# EAGLE design main (EAGLE 9.5.2)
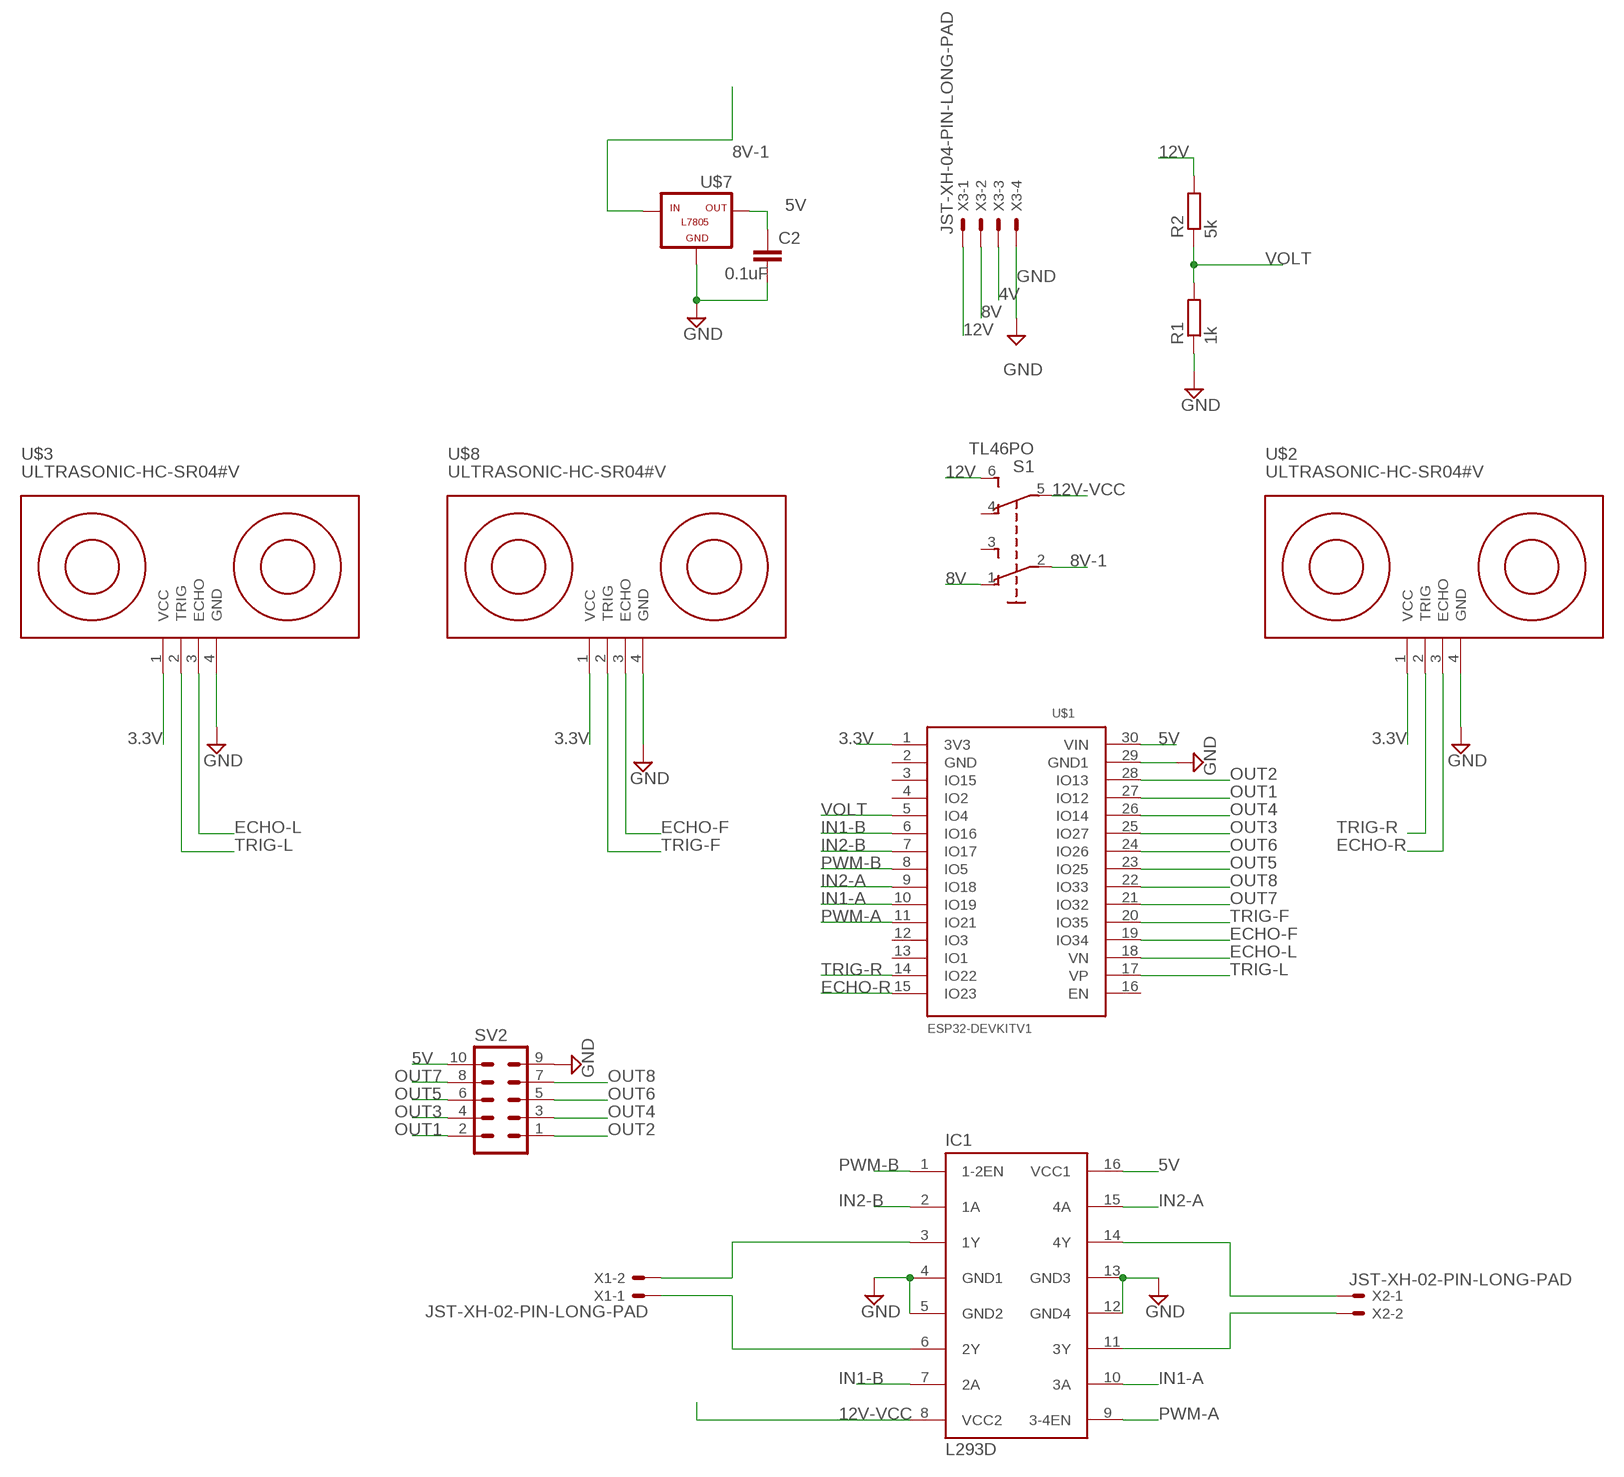
[diagram p0: schematic, sheet 1]

## Parts
C2  0.1uF  C2,5-3  [C2.5-3]
IC1  L293D  [DIL16]
R1  1k  R-EU_0207/10  [0207/10]
R2  5k  R-EU_0207/10  [0207/10]
S1  TL46PO  [TL4XPO]
SV2  MA05-2  [MA05-2]
U$1  ESP32DEVKITV1  [ESP32-DEVKITV1]
U$2  ULTRASONIC-HC-SR04#V  [ULTRASONIC-HC-SR04#V]
U$3  ULTRASONIC-HC-SR04#V  [ULTRASONIC-HC-SR04#V]
U$7  -L7805  [L7805]
U$8  ULTRASONIC-HC-SR04#V  [ULTRASONIC-HC-SR04#V]
X1  JST-XH-02-PIN-LONG-PAD  [JST-XH-02-PACKAGE-LONG-PAD]
X2  JST-XH-02-PIN-LONG-PAD  [JST-XH-02-PACKAGE-LONG-PAD]
X3  JST-XH-04-PIN-LONG-PAD  [JST-XH-04-PACKAGE-LONG-PAD]

## Nets
3.3V: U$1.1(3V3) U$2.1(VCC) U$3.1(VCC) U$8.1(VCC)
4V: X3.3
5V: C2.1 IC1.16(VCC1) SV2.10 U$1.30(VIN) U$7.OUT
8V: S1.1(O) X3.2
8V-1: S1.2(P) U$7.IN
12V: R2.2 S1.6(S1) X3.1
12V-VCC: IC1.8(VCC2) S1.5(P1)
ECHO-F: U$1.19(IO34) U$8.3(ECHO)
ECHO-L: U$1.18(VN) U$3.3(ECHO)
ECHO-R: U$1.15(IO23) U$2.3(ECHO)
GND: C2.2 IC1.4(GND1) IC1.5(GND2) IC1.12(GND4) IC1.13(GND3) R1.1 SV2.9 U$1.29(GND1) U$2.4(GND) U$3.4(GND) U$7.GND U$8.4(GND) X3.4
IN1-A: IC1.10(3A) U$1.10(IO19)
IN1-B: IC1.7(2A) U$1.6(IO16)
IN2-A: IC1.15(4A) U$1.9(IO18)
IN2-B: IC1.2(1A) U$1.7(IO17)
N$1: IC1.3(1Y) X1.2
N$2: IC1.6(2Y) X1.1
N$3: IC1.14(4Y) X2.1
N$4: IC1.11(3Y) X2.2
OUT1: SV2.2 U$1.27(IO12)
OUT2: SV2.1 U$1.28(IO13)
OUT3: SV2.4 U$1.25(IO27)
OUT4: SV2.3 U$1.26(IO14)
OUT5: SV2.6 U$1.23(IO25)
OUT6: SV2.5 U$1.24(IO26)
OUT7: SV2.8 U$1.21(IO32)
OUT8: SV2.7 U$1.22(IO33)
PWM-A: IC1.9(3-4EN) U$1.11(IO21)
PWM-B: IC1.1(1-2EN) U$1.8(IO5)
TRIG-F: U$1.20(IO35) U$8.2(TRIG)
TRIG-L: U$1.17(VP) U$3.2(TRIG)
TRIG-R: U$1.14(IO22) U$2.2(TRIG)
VOLT: R1.2 R2.1 U$1.5(IO4)
Unconnected: S1.3(S) S1.4(O1) U$1.2(GND) U$1.3(IO15) U$1.4(IO2) U$1.12(IO3) U$1.13(IO1) U$1.16(EN)

## Library data of the parts
C2 = capacitor-wima:C: CAPACITOR naming: grid - package width
IC1 = st-microelectronics:L293D: PUSH-PULL 4 CHANNEL DRIVER
R1 R2 = rcl:R-EU_: RESISTOR, European symbol; SPICEPREFIX: R
S1 = switch:TL46PO: TINY SWITCH ON - ON Source: http://www2.produktinfo.conrad.com/datenblaetter/700000-724999/705152-da-01-de-Subminiaturschalter_TL_36YO.pdf
SV2 = con-lstb:MA05-2: PIN HEADER; OC_FARNELL: unknown; OC_NEWARK: unknown
U$1 = ESP32-DEVKITV1:ESP32DEVKITV1
U$2 U$3 U$8 = diy-modules:ULTRASONIC-HC-SR04: Ultrasonic Ranging Module HC-SR04 More details available here: http://randomnerdtutorials.com/complete-guide-for-ultrasonic-sensor-hc-sr04/ Click here to find device on ebay.com <http://www.ebay.com/sch/hc+sr04+ultrasonic>
U$7 = tango:-L7805
X1 X2 = Rembrandt Electronics - JST XH Connectors v1-0:JST-XH-02-PIN: JST XH Connector 2 Pin Wire to board connector. Pitch: 2,54 mm, (0.100") Number of pins: 2 Created by Rembrandt Electronics www.rembrandtelectronics.com
X3 = Rembrandt Electronics - JST XH Connectors v1-0:JST-XH-04-PIN: JST XH Connector 2 Pin Wire to board connector. Pitch: 2,54 mm, (0.100") Number of pins: 4 Created by Rembrandt Electronics www.rembrandtelectronics.com

## Board
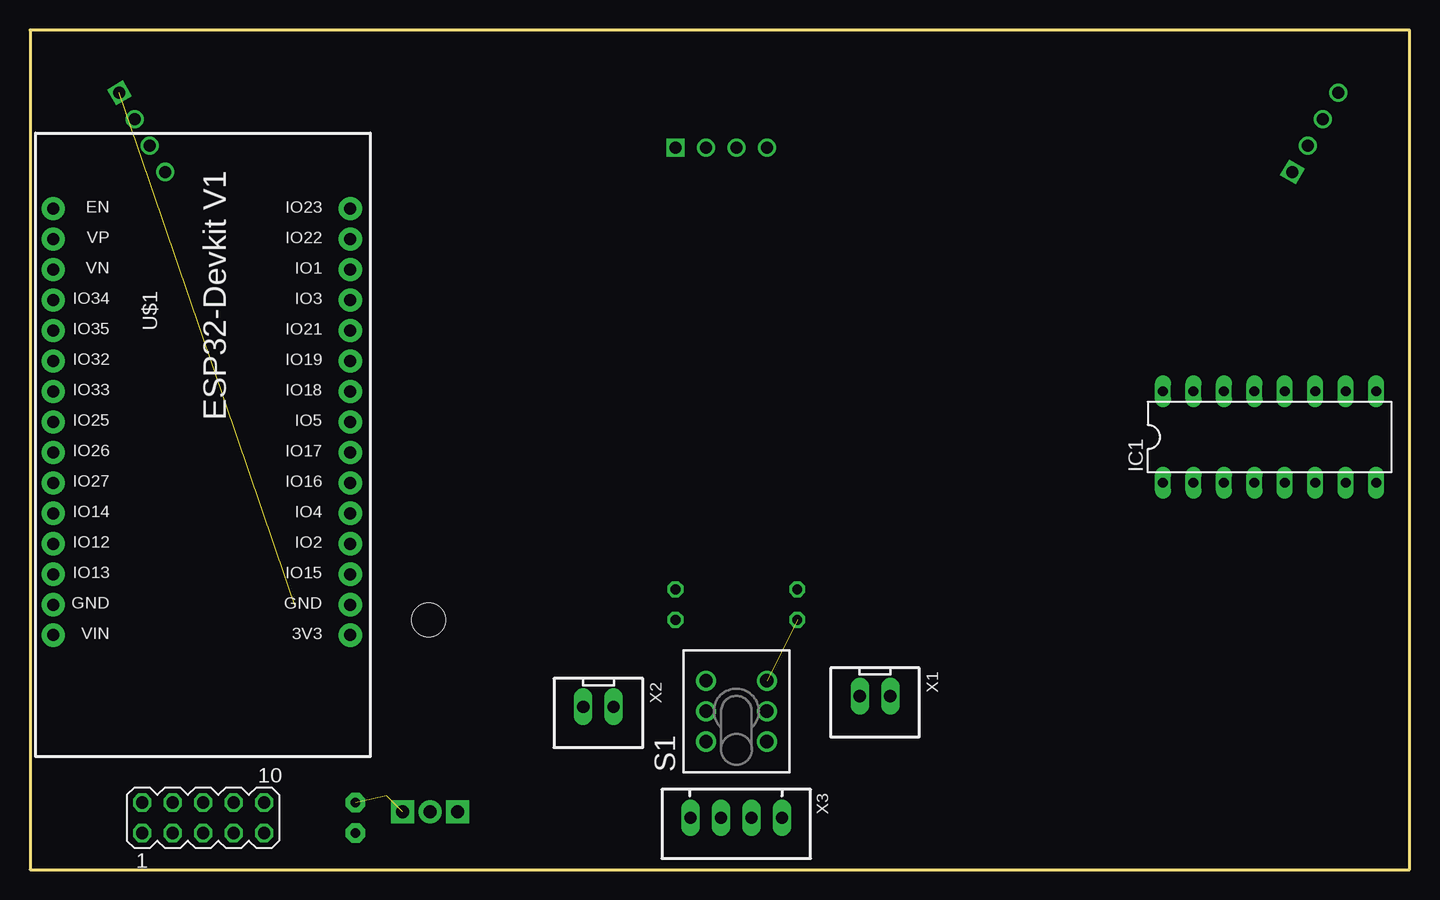
[diagram p1: board, top side]
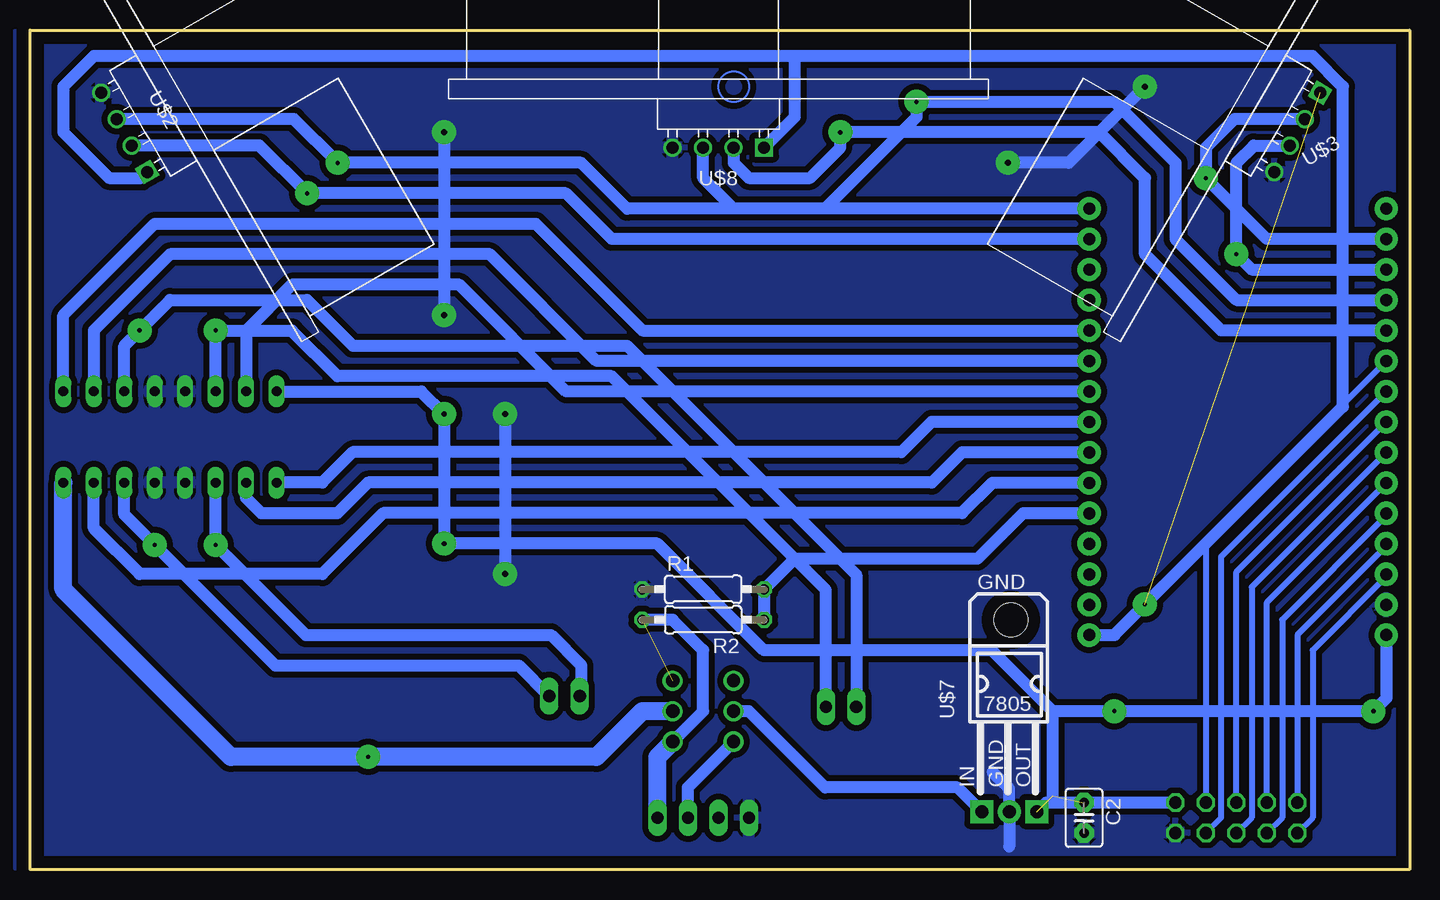
[diagram p2: board, bottom side, seen from below]

Size 115 x 70 mm. Coordinates in mm from the lower left corner, seen from the top.
Outline: 0,70 0,0 115,0 115,70 0,70
Copper layers (1+2*15+16): layer 1 0.035mm / dielectric 1.5mm / Route2 0.035mm / dielectric 0.15mm / Route15 0.035mm / dielectric 0.2mm / Bottom 0.035mm
Design rules "default *": minimum track width 6mil, minimum drill 0.35mm, track to track 6mil, track to pad 6mil, pad to pad 6mil, via to via 6mil, smd to smd 6mil, copper to edge 40mil, drill to drill 6mil, minimum pad ring 10mil, minimum via ring 8mil, stop-mask expansion 4mil, vias tented up to drill 0mil, thermal gap 10mil

### Footprints (pad centres in the part's own frame; a part is rotated, then mirrored left to right if it is on the bottom)
C2.5-3 = drill 0.813 pad 1.6 octagon: 1 -1.27,0; 2 1.27,0
DIL16 = drill 0.813 long: 1 -8.89,-3.81; 2 -6.35,-3.81; 3 -3.81,-3.81; 4 -1.27,-3.81; 5 1.27,-3.81; 6 3.81,-3.81; 7 6.35,-3.81; 8 8.89,-3.81; 9 8.89,3.81; 10 6.35,3.81; 11 3.81,3.81; 12 1.27,3.81; 13 -1.27,3.81; 14 -3.81,3.81; 15 -6.35,3.81; 16 -8.89,3.81
0207/10 = drill 0.813 octagon: 1 -5.08,0; 2 5.08,0
TL4XPO = drill 1.1 pad 1.676: 1 -2.54,2.54; 2 0,2.54; 3 2.54,2.54; 4 -2.54,-2.54; 5 0,-2.54; 6 2.54,-2.54
MA05-2 = drill 1.016 octagon: 1 -5.08,-1.27; 2 -5.08,1.27; 3 -2.54,-1.27; 4 -2.54,1.27; 5 0,-1.27; 6 0,1.27; 7 2.54,-1.27; 8 2.54,1.27; 9 5.08,-1.27; 10 5.08,1.27
ESP32-DEVKITV1 = drill 1 pad 1.93: 1 -22.87,-13.54; 2 -20.33,-13.54; 3 -17.79,-13.54; 4 -15.25,-13.54; 5 -12.71,-13.54; 6 -10.17,-13.54; 7 -7.63,-13.54; 8 -5.09,-13.54; 9 -2.55,-13.54; 10 -0.01,-13.54; 11 2.53,-13.54; 12 5.07,-13.54; 13 7.61,-13.54; 14 10.15,-13.54; 15 12.69,-13.54; 16 12.69,11.23; 17 10.15,11.23; 18 7.61,11.23; 19 5.07,11.23; 20 2.53,11.23; 21 -0.01,11.23; 22 -2.55,11.23; 23 -5.09,11.23; 24 -7.63,11.23; 25 -10.17,11.23; 26 -12.71,11.23; 27 -15.25,11.23; 28 -17.79,11.23; 29 -20.33,11.23; 30 -22.87,11.23
ULTRASONIC-HC-SR04#V = drill 1 square: 1 -3.81,0 | drill 1: 2 -1.27,0; 3 1.27,0; 4 3.81,0
L7805 = drill 1.1 pad 1.93: GND 0.127,-9.652 | drill 1.1 pad 1.93 square: IN -2.159,-9.652; OUT 2.413,-9.652 | hole 2.8: 0.254,6.35
JST-XH-02-PACKAGE-LONG-PAD = drill 1.016 long: 1 -1.27,0; 2 1.27,0
JST-XH-04-PACKAGE-LONG-PAD = drill 1.016 long: 1 -3.81,0; 2 -1.27,0; 3 1.27,0; 4 3.81,0

### Placement (x,y rotation side)
C2  27.13,4.31 270 bottom
IC1  103.33,36.06 0 top
R1  58.88,23.36 0 bottom
R2  58.88,20.82 180 bottom
S1  58.88,13.2 90 top
SV2  14.43,4.31 0 top
U$1  13.16,42.41 90 top
U$2  107.14,61.46 120 bottom
U$3  9.35,61.46 240 bottom
U$7  33.48,14.47 0 bottom
U$8  57.61,60.19 180 bottom
X1  70.44,14.46 180 top
X2  47.39,13.57 180 top
X3  58.88,4.31 180 top

### Tracks (layer width: path | path; a pad name or v marks a point on that pad's centre or on a via)
3.3V  (via drill 0.35 pad 2 layers 16-16)  (1 unrouted)
  Bottom 1: U$3.1 7.32,64.76 | U$1.1 24.6,19.54 v22.05,22.09 5.54,38.6 5.54,65.27 8.08,67.81 51.26,67.81 | U$2.1 105.75,57.65 108.41,57.65 112.22,61.46 112.22,65.27 109.68,67.81 51.26,67.81 | 51.26,67.81 51.26,62.73 U$8.1
5V  (via drill 0.35 pad 2 layers 16-16, 0.4 pad 2 layers 16-16)  (2 unrouted)
  Bottom 1: IC1.16 82.38,39.87 v80.47,37.97 v80.47,27.17 62.69,27.17 53.8,18.28 34.81,18.28 29.73,13.2 | 29.73,13.2 v24.59,13.2 v3,13.2 1.93,14.27 U$1.30 | 29.73,6.16 29.73,13.2 | SV2.10 30.31,5.58 U$7.OUT
8V
  Bottom 1: X3.2 60.15,6.85 S1.1
8V-1
  Bottom 1: U$7.IN 37.67,6.85 48.72,6.85 55.07,13.2 S1.2
12V  (1 unrouted)
  Bottom 1: 61.42,10.66 58.88,13.2 58.88,18.28 61.42,20.82 R2.2
  Bottom 1.5: X3.1 62.69,9.39 61.42,10.66
12V-VCC  (via drill 0.35 pad 2 layers 16-16)
  Bottom 1.5: IC1.8 112.22,23.36 98.25,9.39 v86.82,9.39 67.77,9.39 63.96,13.2 S1.5
ECHO-F  (via drill 0.35 pad 2 layers 16-16)
  Bottom 1: U$8.3 58.88,57.65 56.34,55.11 48.72,55.11 41.1,62.73 v41.1,64 24.59,64 19.51,58.92 19.51,52.57 14.42,47.48 U$1.19
ECHO-L  (via drill 0.35 pad 2 layers 16-16)
  Bottom 1: U$1.18 13.15,50.02 v14.43,51.3 14.43,58.92 12.99,60.36 U$3.3
ECHO-R  (via drill 0.35 pad 2 layers 16-16)
  Bottom 1: U$1.15 65.22,55.1 69.04,58.92 v89.36,58.92 93,62.56 U$2.3
GND  (via drill 0.5 pad 2 layers 16-16)
  Bottom 1: 34.75,8.12 33.36,6.73 U$7.GND 33.36,1.9 | v22.05,65.27 28.4,58.92 v33.48,58.92 | v80.47,61.46 v80.47,46.22 | v75.39,37.97 v75.39,24.63
  pour Bottom (isolate 1): -0.81,70.35 -0.81,-0.77 116.03,-0.77 116.03,70.35
  pour Bottom (isolate 0.5): -0.81,70.35 116.03,70.35 116.03,-0.77 -0.81,-0.77
IN1-A
  Bottom 1: U$1.10 67.76,42.4 76.66,51.3 103.33,51.3 109.68,44.95 IC1.10
IN1-B
  Bottom 1: U$1.6 34.76,32.24 37.29,29.71 85.55,29.71 90.63,24.63 105.87,24.63 109.68,28.44 IC1.7
IN2-A
  Bottom 1: U$1.9 70.3,39.86 79.2,48.76 93.17,48.76 96.98,44.95 IC1.15
IN2-B
  Bottom 1: U$1.7 37.3,34.78 39.83,32.25 86.82,32.25 89.36,29.71 95.71,29.71 96.98,30.98 IC1.2
N$1  (via drill 0.35 pad 2 layers 16-16)
  Bottom 1: IC1.3 v99.52,27.06 92.01,19.55 71.58,19.55 69.04,17.01 69.04,14.58 X1.2
N$2  (via drill 0.35 pad 2 layers 16-16)
  Bottom 1: 104.6,27.17 v104.6,27.06 | v104.6,27.06 107.14,29.6 IC1.6 | v104.6,27.06 94.55,17.01 74.27,17.01 X1.1
N$3  (via drill 0.35 pad 2 layers 16-16)
  Bottom 1: 48.72,14.57 X2.1 48.66,23.3 66.5,41.14 89.36,41.14 93.17,44.95 v99.52,44.95 IC1.14
N$4  (via drill 0.35 pad 2 layers 16-16)
  Bottom 1: IC1.11 107.14,43.68 v105.87,44.95 103.33,47.49 91.9,47.49 88.09,43.68 65.23,43.68 46.12,24.57 X2.2
N$7
  pour Bottom (isolate 0.5): 0,70 0,0 116.27,0 116.27,70
OUT1
  Bottom 0.5: SV2.2 9.35,19.55 1.93,26.97 U$1.27
OUT2
  Bottom 0.5: SV2.1 8.08,4.31 8.08,18.28 1.93,24.43 U$1.28
OUT3
  Bottom 0.5: U$1.25 11.89,22.28 SV2.4
OUT4
  Bottom 0.5: U$1.26 1.93,29.51 10.62,20.82 10.62,4.31 SV2.3
OUT5
  Bottom 0.5: U$1.23 14.43,24.82 SV2.6
OUT6
  Bottom 0.5: U$1.24 13.16,23.55 13.16,4.31 SV2.5
OUT7
  Bottom 0.5: U$1.21 16.97,27.36 SV2.8
OUT8
  Bottom 0.5: SV2.7 15.7,4.31 15.7,26.09 U$1.22
PWM-A
  Bottom 1: U$1.11 63.95,44.94 72.85,53.84 104.6,53.84 112.22,46.22 IC1.9
PWM-B
  Bottom 1: U$1.8 39.84,37.32 42.37,34.79 88.09,34.79 90.63,32.25 IC1.1
TRIG-F  (via drill 0.35 pad 2 layers 16-16)
  Bottom 1: U$8.2 56.34,58.92 55.07,57.65 49.99,57.65 47.45,60.19 v47.45,61.46 25.86,61.46 22.05,57.65 22.05,51.3 15.69,44.94 U$1.20
TRIG-L  (via drill 0.35 pad 2 layers 16-16)
  Bottom 1: U$1.17 11.88,52.56 v16.97,57.65 16.97,60.19 14.6,62.56 U$3.2
TRIG-R  (via drill 0.35 pad 2 layers 16-16)
  Bottom 1: U$1.14 66.49,52.56 70.31,56.38 v91.9,56.38 95.88,60.36 U$2.2
VOLT
  Bottom 1: U$1.5 32.22,29.7 36.02,25.9 51.26,25.9 R1.2 R2.1
(copper drawn outside any net)
  shapes: Bottom circle x1